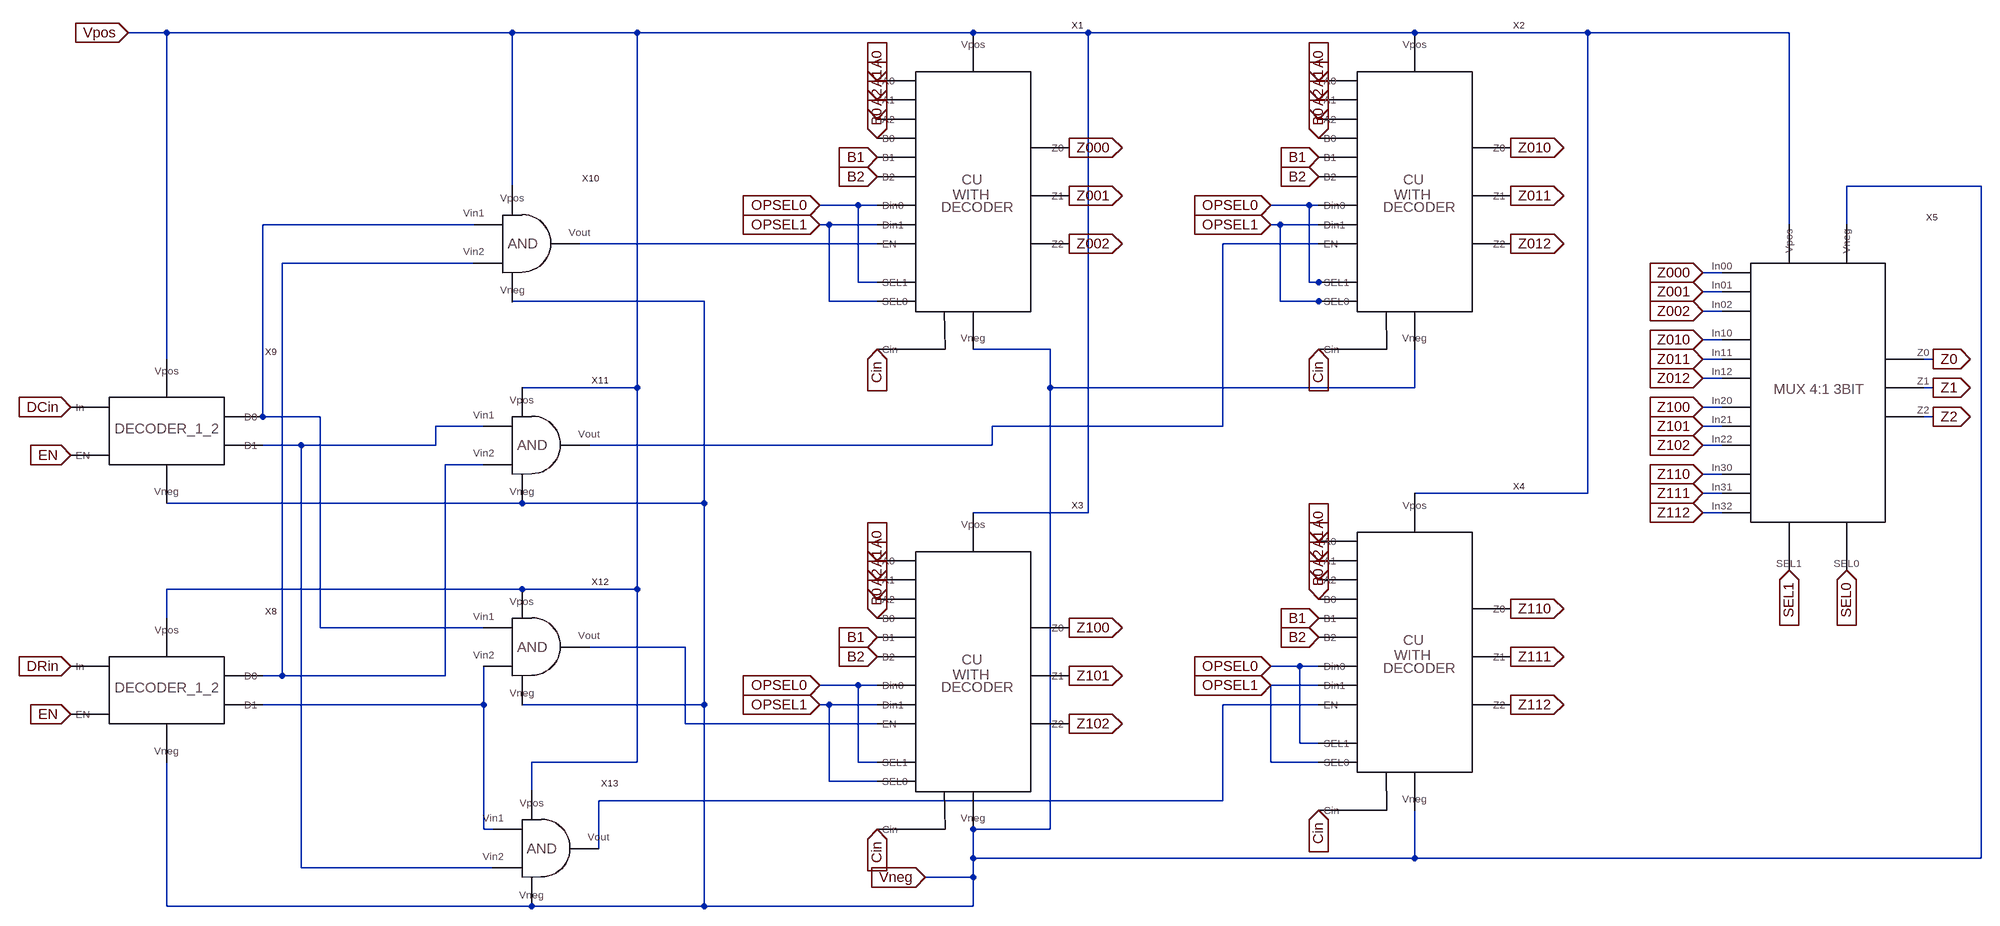
[diagram p0: schematic PART_2_A_SYM.asc]
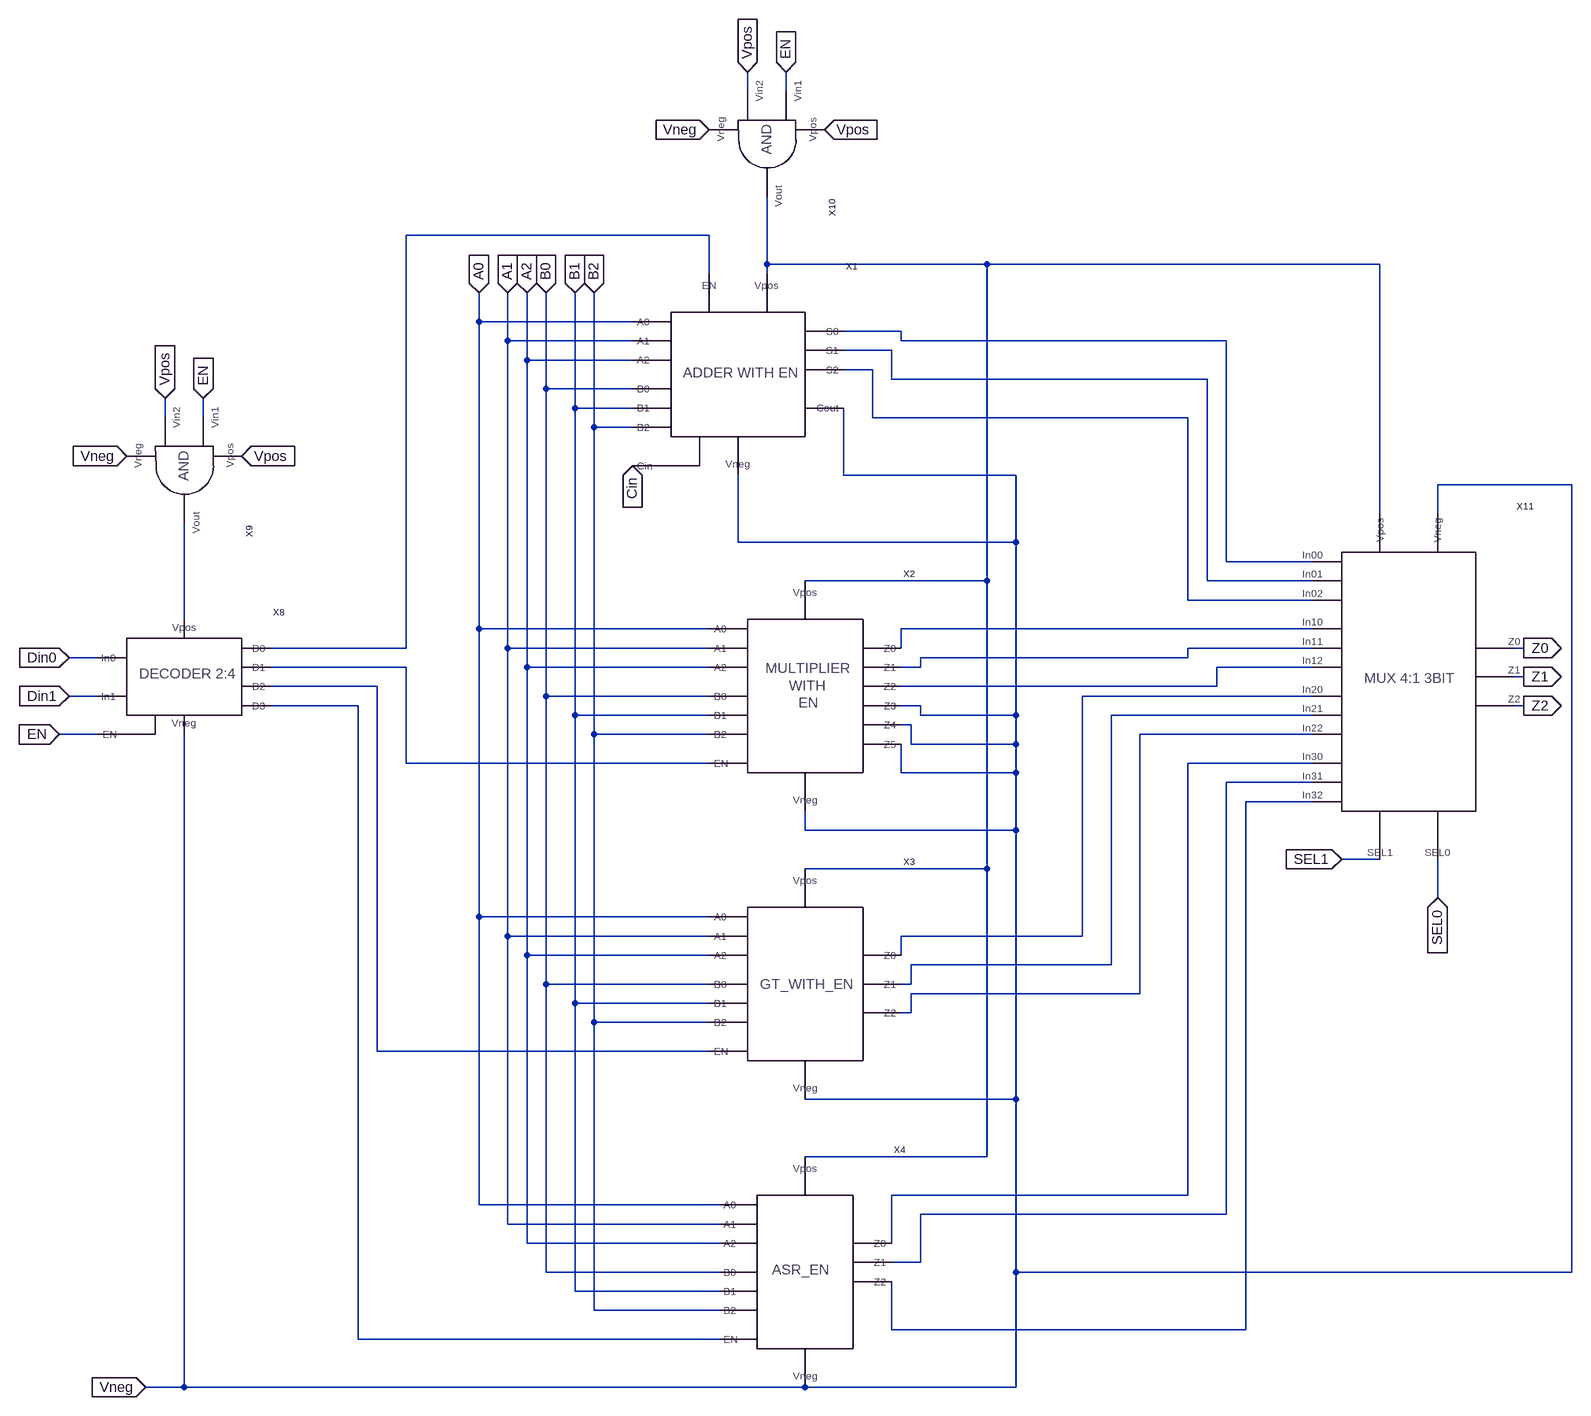
[diagram p1: sub-circuit part_2_b_sym.asc]
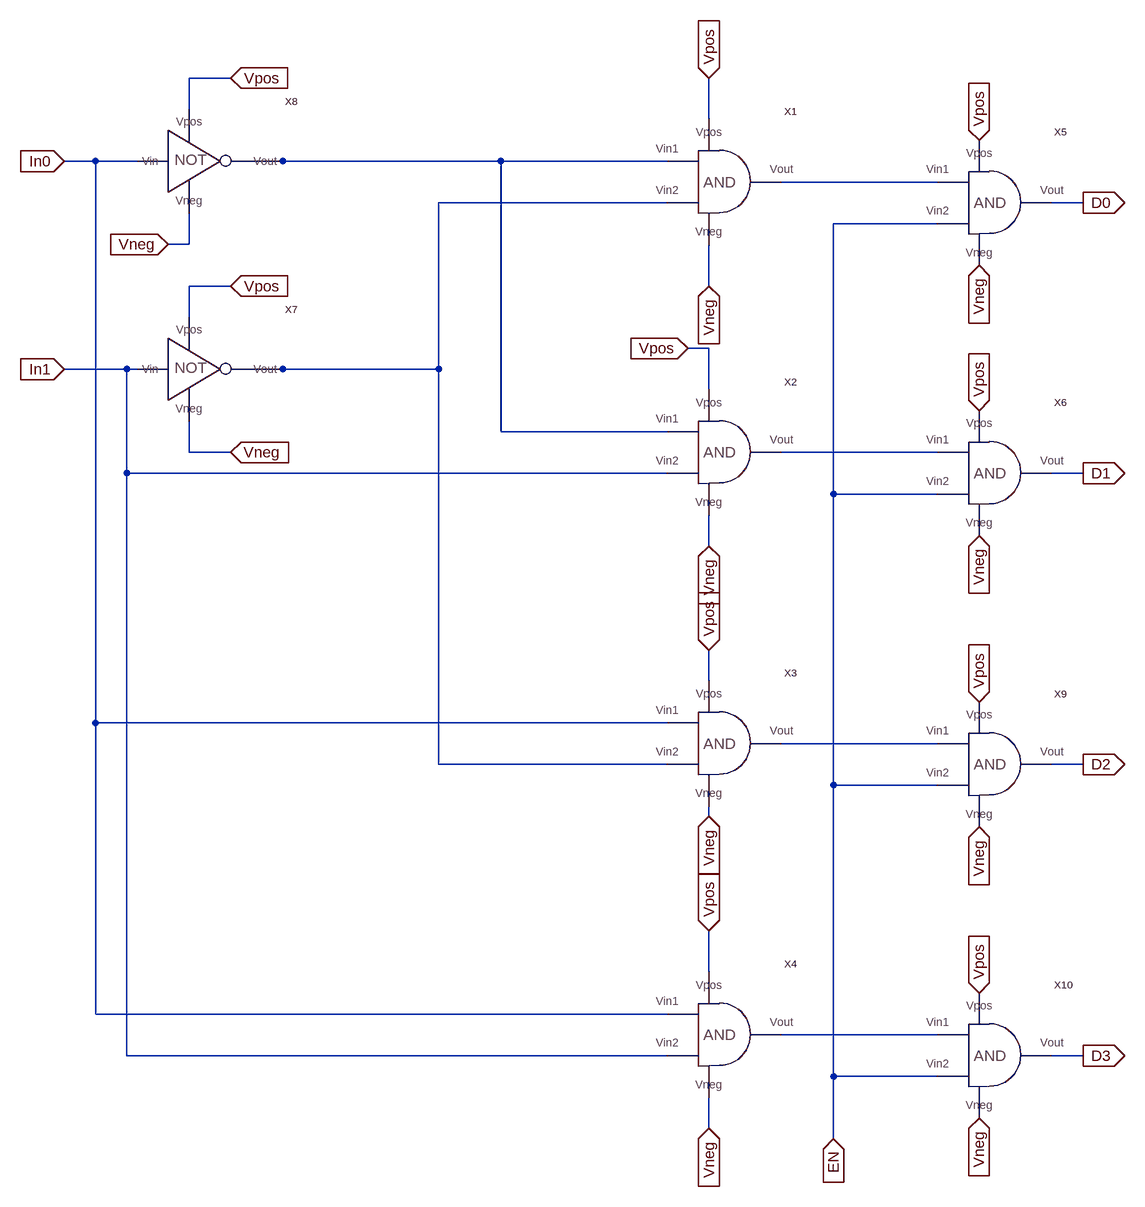
[diagram p2: sub-circuit decoder2_4.asc]
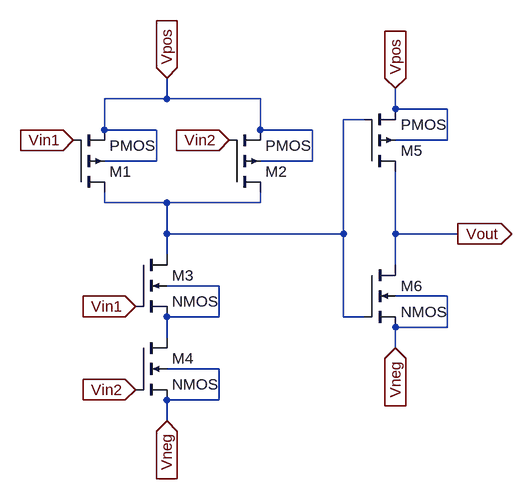
[diagram p3: sub-circuit and_sym.asc]
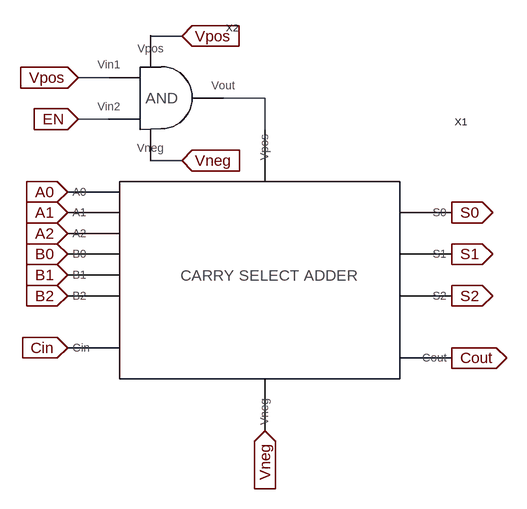
[diagram p4: sub-circuit adder_en_sym.asc]
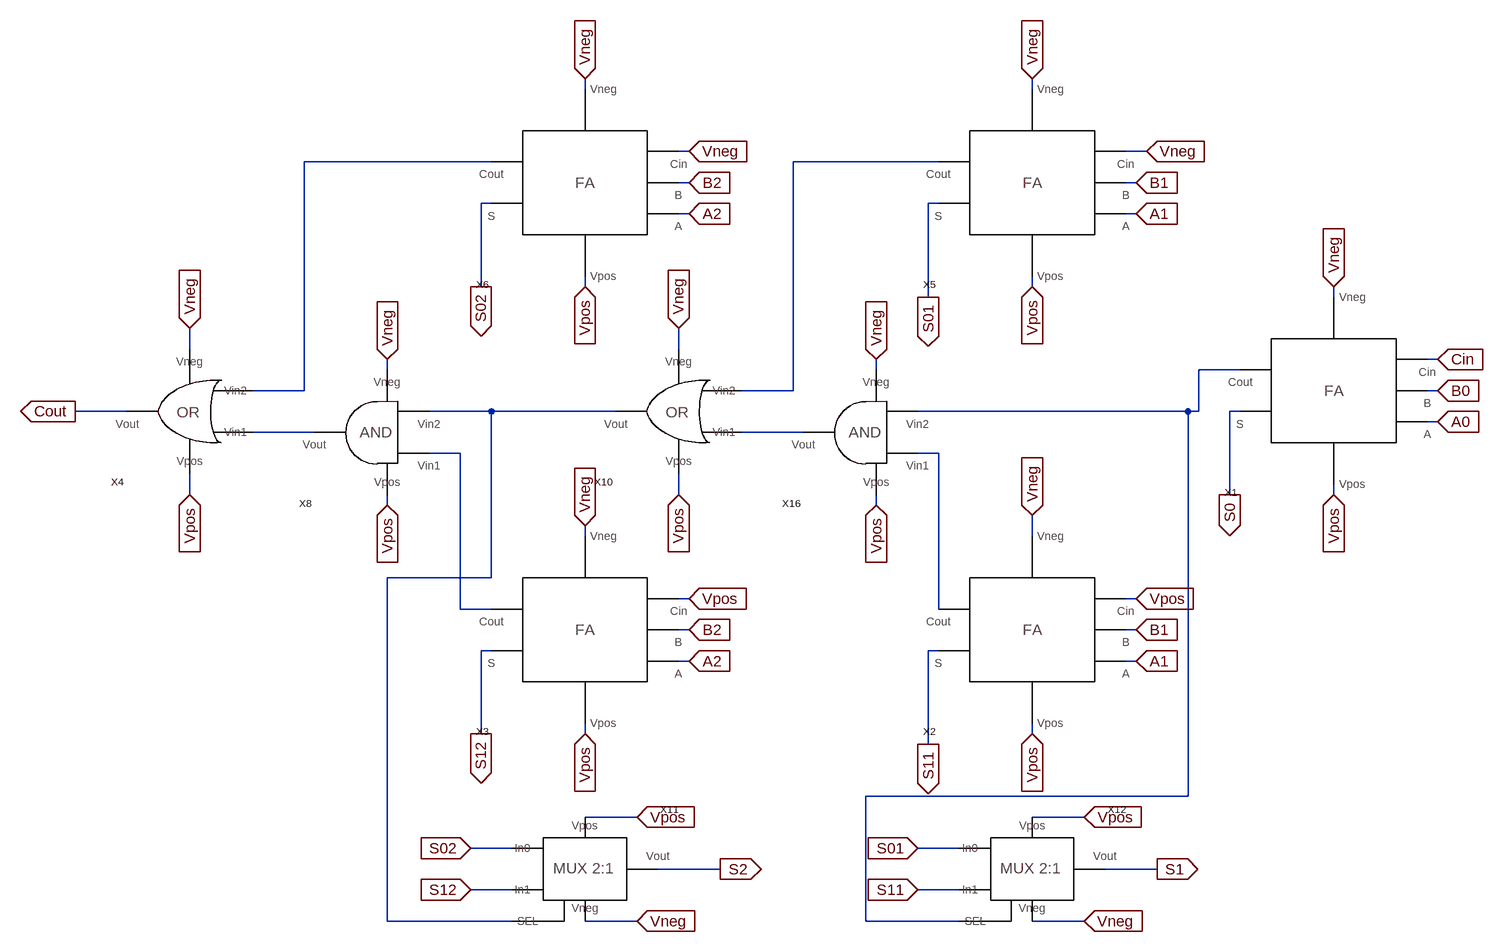
[diagram p5: sub-circuit carry_select_adder_sym.asc]
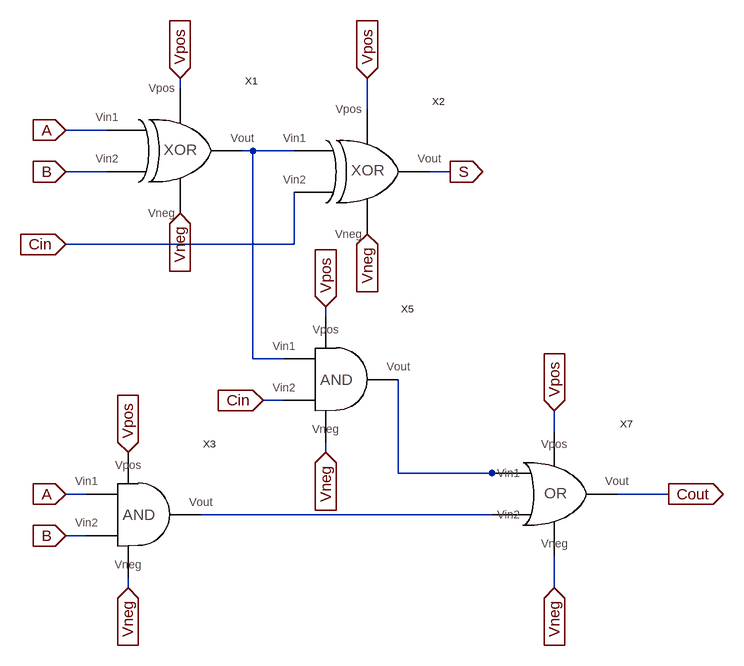
[diagram p6: sub-circuit full_adder_sym.asc]
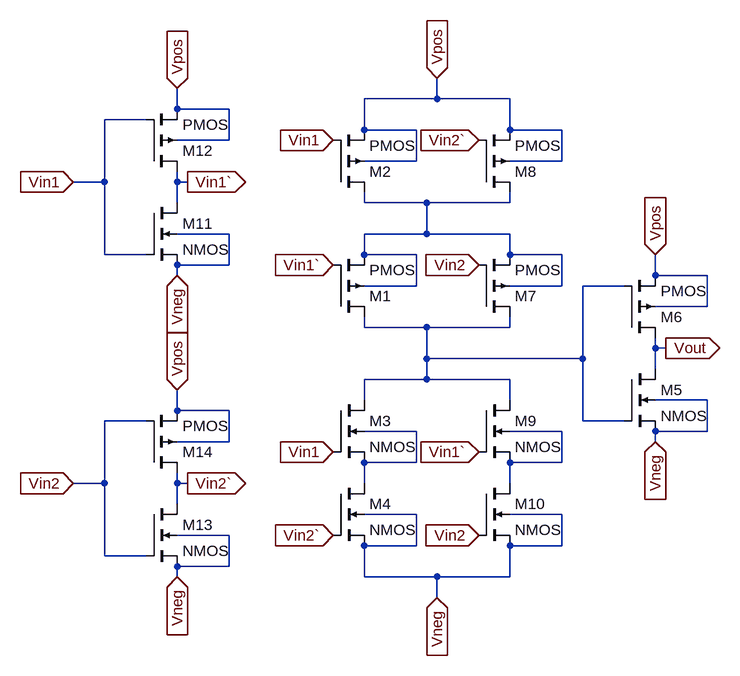
[diagram p7: sub-circuit xor_sym.asc]
PART_2_A_SYM.asc, the LTspice schematic file:
Version 4
SHEET 1 1832 1036
WIRE -1408 -448 -1472 -448
WIRE -832 -448 -1408 -448
WIRE -624 -448 -832 -448
WIRE -64 -448 -624 -448
WIRE 128 -448 -64 -448
WIRE 672 -448 128 -448
WIRE 960 -448 672 -448
WIRE 1296 -448 960 -448
WIRE -832 -192 -832 -448
WIRE 1616 -192 1392 -192
WIRE -256 -160 -320 -160
WIRE -224 -160 -256 -160
WIRE 496 -160 432 -160
WIRE 512 -160 496 -160
WIRE -896 -128 -1248 -128
WIRE -304 -128 -320 -128
WIRE -224 -128 -304 -128
WIRE 448 -128 432 -128
WIRE 512 -128 448 -128
WIRE 1296 -128 1296 -448
WIRE 1392 -128 1392 -192
WIRE -224 -96 -720 -96
WIRE 512 -96 352 -96
WIRE -896 -64 -1216 -64
WIRE 1184 -48 1152 -48
WIRE -256 -32 -256 -160
WIRE -224 -32 -256 -32
WIRE 496 -32 496 -160
WIRE 512 -32 496 -32
WIRE 528 -32 512 -32
WIRE 1184 -16 1152 -16
WIRE -512 0 -832 0
WIRE -304 0 -304 -128
WIRE -224 0 -304 0
WIRE 448 0 448 -128
WIRE 512 0 448 0
WIRE 528 0 512 0
WIRE 1184 16 1152 16
WIRE 1184 64 1152 64
WIRE 64 80 -64 80
WIRE -1408 96 -1408 -448
WIRE 1184 96 1152 96
WIRE 1536 96 1520 96
WIRE 1184 128 1152 128
WIRE -624 144 -624 -448
WIRE -624 144 -816 144
WIRE 64 144 64 80
WIRE 672 144 672 80
WIRE 672 144 64 144
WIRE 1536 144 1520 144
WIRE 1184 176 1152 176
WIRE -1248 192 -1248 -128
WIRE -1152 192 -1248 192
WIRE 1536 192 1520 192
WIRE -880 208 -960 208
WIRE 352 208 352 -96
WIRE 352 208 -32 208
WIRE 1184 208 1152 208
WIRE -1184 240 -1248 240
WIRE -960 240 -960 208
WIRE -960 240 -1184 240
WIRE -32 240 -32 208
WIRE -32 240 -704 240
WIRE 1184 240 1152 240
WIRE -880 272 -944 272
WIRE 1184 288 1152 288
WIRE 960 320 960 -448
WIRE 960 320 672 320
WIRE 1184 320 1152 320
WIRE -816 336 -1408 336
WIRE -512 336 -512 0
WIRE -512 336 -816 336
WIRE 128 352 128 -448
WIRE 128 352 -64 352
WIRE 1184 352 1152 352
WIRE -816 480 -1408 480
WIRE -624 480 -624 144
WIRE -624 480 -816 480
WIRE -1408 528 -1408 480
WIRE -1152 544 -1152 192
WIRE -880 544 -1152 544
WIRE -544 576 -704 576
WIRE 480 608 432 608
WIRE 512 608 480 608
WIRE -1216 624 -1216 -64
WIRE -1216 624 -1248 624
WIRE -944 624 -944 272
WIRE -944 624 -1216 624
WIRE -256 640 -320 640
WIRE -224 640 -256 640
WIRE 512 640 432 640
WIRE -880 672 -880 608
WIRE -880 672 -1248 672
WIRE -512 672 -512 336
WIRE -512 672 -816 672
WIRE -304 672 -320 672
WIRE -224 672 -304 672
WIRE 512 672 352 672
WIRE -544 704 -544 576
WIRE -224 704 -544 704
WIRE 480 736 480 608
WIRE 512 736 480 736
WIRE -624 768 -624 480
WIRE -624 768 -800 768
WIRE -256 768 -256 640
WIRE -224 768 -256 768
WIRE 432 768 432 640
WIRE 512 768 432 768
WIRE -304 800 -304 672
WIRE -224 800 -304 800
WIRE -800 816 -800 768
WIRE 352 832 352 672
WIRE 352 832 -688 832
WIRE -880 880 -880 672
WIRE -864 880 -880 880
WIRE 64 880 64 144
WIRE 64 880 -64 880
WIRE -688 912 -688 832
WIRE -64 928 -64 880
WIRE 672 928 672 848
WIRE 672 928 -64 928
WIRE 1616 928 1616 -192
WIRE 1616 928 672 928
WIRE -1184 944 -1184 240
WIRE -864 944 -1184 944
WIRE -64 960 -64 928
WIRE -64 960 -144 960
WIRE -1408 1008 -1408 768
WIRE -800 1008 -1408 1008
WIRE -512 1008 -512 672
WIRE -512 1008 -800 1008
WIRE -64 1008 -64 960
WIRE -64 1008 -512 1008
FLAG -224 -368 A0
IOPIN -224 -368 In
FLAG -224 -336 A1
IOPIN -224 -336 In
FLAG -224 -304 A2
IOPIN -224 -304 In
FLAG -224 -272 B0
IOPIN -224 -272 In
FLAG -224 -240 B1
IOPIN -224 -240 In
FLAG -224 -208 B2
IOPIN -224 -208 In
FLAG -1568 176 DCin
IOPIN -1568 176 In
FLAG -1568 608 DRin
IOPIN -1568 608 In
FLAG 1296 448 SEL1
IOPIN 1296 448 In
FLAG 1392 448 SEL0
IOPIN 1392 448 In
FLAG -320 -160 OPSEL0
IOPIN -320 -160 In
FLAG -320 -128 OPSEL1
IOPIN -320 -128 In
FLAG -1568 256 EN
IOPIN -1568 256 In
FLAG -1568 688 EN
IOPIN -1568 688 In
FLAG -224 432 A0
IOPIN -224 432 In
FLAG -224 464 A1
IOPIN -224 464 In
FLAG -224 496 A2
IOPIN -224 496 In
FLAG -224 528 B0
IOPIN -224 528 In
FLAG -224 560 B1
IOPIN -224 560 In
FLAG -224 592 B2
IOPIN -224 592 In
FLAG 1536 96 Z0
IOPIN 1536 96 Out
FLAG 1536 144 Z1
IOPIN 1536 144 Out
FLAG 1536 192 Z2
IOPIN 1536 192 Out
FLAG -1472 -448 Vpos
IOPIN -1472 -448 In
FLAG 512 -368 A0
IOPIN 512 -368 In
FLAG 512 -336 A1
IOPIN 512 -336 In
FLAG 512 -304 A2
IOPIN 512 -304 In
FLAG 512 -272 B0
IOPIN 512 -272 In
FLAG 512 -240 B1
IOPIN 512 -240 In
FLAG 512 -208 B2
IOPIN 512 -208 In
FLAG 512 400 A0
IOPIN 512 400 In
FLAG 512 432 A1
IOPIN 512 432 In
FLAG 512 464 A2
IOPIN 512 464 In
FLAG 512 496 B0
IOPIN 512 496 In
FLAG 512 528 B1
IOPIN 512 528 In
FLAG 512 560 B2
IOPIN 512 560 In
FLAG 96 -256 Z000
IOPIN 96 -256 Out
FLAG 96 -176 Z001
IOPIN 96 -176 Out
FLAG 96 -96 Z002
IOPIN 96 -96 Out
FLAG 96 544 Z100
IOPIN 96 544 Out
FLAG 96 624 Z101
IOPIN 96 624 Out
FLAG 96 704 Z102
IOPIN 96 704 Out
FLAG 832 512 Z110
IOPIN 832 512 Out
FLAG 832 592 Z111
IOPIN 832 592 Out
FLAG 832 672 Z112
IOPIN 832 672 Out
FLAG 832 -256 Z010
IOPIN 832 -256 Out
FLAG 832 -176 Z011
IOPIN 832 -176 Out
FLAG 832 -96 Z012
IOPIN 832 -96 Out
FLAG 1152 -48 Z000
IOPIN 1152 -48 In
FLAG 1152 64 Z010
IOPIN 1152 64 In
FLAG 1152 176 Z100
IOPIN 1152 176 In
FLAG 1152 288 Z110
IOPIN 1152 288 In
FLAG 1152 -16 Z001
IOPIN 1152 -16 In
FLAG 1152 96 Z011
IOPIN 1152 96 In
FLAG 1152 208 Z101
IOPIN 1152 208 In
FLAG 1152 320 Z111
IOPIN 1152 320 In
FLAG 1152 16 Z002
IOPIN 1152 16 In
FLAG 1152 128 Z012
IOPIN 1152 128 In
FLAG 1152 240 Z102
IOPIN 1152 240 In
FLAG 1152 352 Z112
IOPIN 1152 352 In
FLAG -144 960 Vneg
IOPIN -144 960 In
FLAG 512 848 Cin
IOPIN 512 848 In
FLAG -224 880 Cin
IOPIN -224 880 In
FLAG 512 80 Cin
IOPIN 512 80 In
FLAG -224 80 Cin
IOPIN -224 80 In
FLAG 432 -160 OPSEL0
IOPIN 432 -160 In
FLAG 432 -128 OPSEL1
IOPIN 432 -128 In
FLAG -320 640 OPSEL0
IOPIN -320 640 In
FLAG -320 672 OPSEL1
IOPIN -320 672 In
FLAG 432 608 OPSEL0
IOPIN 432 608 In
FLAG 432 640 OPSEL1
IOPIN 432 640 In
SYMBOL part_2_b_sym -64 -176 R0
SYMATTR InstName X1
SYMBOL part_2_b_sym 672 -176 R0
SYMATTR InstName X2
SYMBOL part_2_b_sym -64 624 R0
SYMATTR InstName X3
SYMBOL part_2_b_sym 672 592 R0
SYMATTR InstName X4
SYMBOL DECODER_1_2_SYM -1408 640 R0
SYMATTR InstName X8
SYMBOL DECODER_1_2_SYM -1408 208 R0
SYMATTR InstName X9
SYMBOL AND_SYM -816 -96 R0
SYMATTR InstName X10
SYMBOL AND_SYM -800 240 R0
SYMATTR InstName X11
SYMBOL AND_SYM -800 576 R0
SYMATTR InstName X12
SYMBOL AND_SYM -784 912 R0
SYMATTR InstName X13
SYMBOL MUX3BIT_SYM 1344 64 R0
SYMATTR InstName X5

The netlist it stands for:
* PART_2_A_SYM.asc
XX1 A0 A1 A2 B0 B1 B2 OPSEL0 OPSEL1 N002 OPSEL0 OPSEL1 Vpos Vneg Z000 Z001 Z002 Cin part_2_b_sym
XX2 A0 A1 A2 B0 B1 B2 OPSEL0 OPSEL1 N003 OPSEL0 OPSEL1 Vpos Vneg Z010 Z011 Z012 Cin part_2_b_sym
XX3 A0 A1 A2 B0 B1 B2 OPSEL0 OPSEL1 N006 OPSEL0 OPSEL1 Vpos Vneg Z100 Z101 Z102 Cin part_2_b_sym
XX4 A0 A1 A2 B0 B1 B2 OPSEL0 OPSEL1 N008 OPSEL0 OPSEL1 Vpos Vneg Z110 Z111 Z112 Cin part_2_b_sym
XX8 DRin EN Vpos Vneg N004 N007 decoder_1_2_sym
XX9 DCin EN Vpos Vneg N001 N005 decoder_1_2_sym
XX10 N001 N004 Vpos Vneg N002 and_sym
XX11 N005 N004 Vpos Vneg N003 and_sym
XX12 N001 N007 Vpos Vneg N006 and_sym
XX13 N007 N005 Vpos Vneg N008 and_sym
XX5 Vpos Vneg Z000 Z001 Z002 Z010 Z011 Z012 Z100 Z101 Z102 Z110 Z111 Z112 Z0 Z1 Z2 SEL0 SEL1 mux3bit_sym

* block symbol definitions
.subckt part_2_b_sym A0 A1 A2 B0 B1 B2 Din0 Din1 EN SEL1 SEL0 Vpos Vneg Z0 Z1 Z2 Cin
XX8 Din0 Din1 N001 N009 N011 N013 Vneg N006 EN decoder2_4
XX1 A0 A1 A2 B0 B1 B2 N002 N001 Vneg N003 N004 N005 Vneg Cin adder_en_sym
XX2 A0 A1 A2 B0 B1 B2 N009 N002 N007 Vneg N008 N010 Vneg Vneg Vneg multiplier_en_sym
XX3 A0 A1 A2 B0 B1 B2 N011 N002 N012 N014 N015 Vneg gt_en_sym
XX4 N002 A0 A1 A2 B0 B1 B2 N013 Vneg N016 N017 N018 asr_en_sym
XX9 EN Vpos Vpos Vneg N006 and_sym
XX10 EN Vpos Vpos Vneg N002 and_sym
XX11 N002 Vneg N003 N004 N005 N007 N008 N010 N012 N014 N015 N016 N017 N018 Z0 Z1 Z2 SEL0 SEL1 mux3bit_sym
.ends part_2_b_sym

.subckt decoder2_4 In0 In1 D0 D1 D2 D3 Vneg Vpos EN
XX1 N001 N003 Vpos Vneg N002 and_sym
XX2 N001 In1 Vpos Vneg N004 and_sym
XX3 In0 N003 Vpos Vneg N005 and_sym
XX4 In0 In1 Vpos Vneg N006 and_sym
XX7 In1 Vpos N003 Vneg NOT_SYM  ; pins Vin Vpos Vout Vneg
XX8 In0 Vpos N001 Vneg NOT_SYM  ; pins Vin Vpos Vout Vneg
XX5 N002 EN Vpos Vneg D0 and_sym
XX6 N004 EN Vpos Vneg D1 and_sym
XX9 N005 EN Vpos Vneg D2 and_sym
XX10 N006 EN Vpos Vneg D3 and_sym
.ends decoder2_4

.subckt and_sym Vin1 Vin2 Vpos Vneg Vout
M1 N001 Vin1 Vpos Vpos PMOS
M2 N001 Vin2 Vpos Vpos PMOS
M3 N001 Vin1 N002 N002 NMOS
M4 N002 Vin2 Vneg Vneg NMOS
M5 Vout N001 Vpos Vpos PMOS
M6 Vout N001 Vneg Vneg NMOS
.ends and_sym

.subckt adder_en_sym A0 A1 A2 B0 B1 B2 Vpos EN Vneg S0 S1 S2 Cout Cin
XX1 A0 A1 A2 B0 B1 B2 Cout N001 Vneg S0 S1 S2 Cin carry_select_adder_sym
XX2 Vpos EN Vpos Vneg N001 and_sym
.ends adder_en_sym

.subckt carry_select_adder_sym A0 A1 A2 B0 B1 B2 Cout Vpos Vneg S0 S1 S2 Cin
XX1 A0 B0 Cin S0 N003 Vpos Vneg full_adder_sym
XX2 A1 B1 Vpos S11 N008 Vpos Vneg full_adder_sym
XX3 A2 B2 Vpos S12 N007 Vpos Vneg full_adder_sym
XX5 A1 B1 Vneg S01 N002 Vpos Vneg full_adder_sym
XX6 A2 B2 Vneg S02 N001 Vpos Vneg full_adder_sym
XX10 Vpos N006 N002 N004 Vneg or_sym
XX11 S02 S12 N004 Vpos Vneg S2 mux2_1
XX12 S01 S11 N003 Vpos Vneg S1 mux2_1
XX16 N008 N003 Vpos Vneg N006 and_sym
XX4 Vpos N005 N001 Cout Vneg or_sym
XX8 N007 N004 Vpos Vneg N005 and_sym
.ends carry_select_adder_sym

.subckt full_adder_sym A B Cin S Cout Vpos Vneg
XX1 A B Vpos N001 Vneg xor_sym
XX2 N001 Cin Vpos S Vneg xor_sym
XX3 A B Vpos Vneg N003 and_sym
XX5 N001 Cin Vpos Vneg N002 and_sym
XX7 Vpos N002 N003 Cout Vneg or_sym
.ends full_adder_sym

.subckt xor_sym Vin1 Vin2 Vpos Vout Vneg
M1 N002 Vin1` N001 N001 PMOS
M2 N001 Vin1 Vpos Vpos PMOS
M3 N002 Vin1 N003 N003 NMOS
M4 N003 Vin2` Vneg Vneg NMOS
M5 Vout N002 Vneg Vneg NMOS
M6 Vout N002 Vpos Vpos PMOS
M7 N002 Vin2 N001 N001 PMOS
M8 N001 Vin2` Vpos Vpos PMOS
M9 N002 Vin1` N004 N004 NMOS
M10 N004 Vin2 Vneg Vneg NMOS
M11 Vin1` Vin1 Vneg Vneg NMOS
M12 Vin1` Vin1 Vpos Vpos PMOS
M13 Vin2` Vin2 Vneg Vneg NMOS
M14 Vin2` Vin2 Vpos Vpos PMOS
.ends xor_sym

.subckt or_sym Vpos Vin1 Vin2 Vout Vneg
M1 N002 Vin1 Vpos Vpos PMOS
M2 N001 Vin2 N002 N002 PMOS
M3 N001 Vin2 Vneg Vneg NMOS
M4 N001 Vin1 Vneg Vneg NMOS
M5 Vout N001 Vpos Vpos PMOS
M6 Vout N001 Vneg Vneg NMOS
.ends or_sym

.subckt mux2_1 In0 In1 SEL Vpos Vneg Vout
XX1 In1 SEL Vpos Vneg N003 and_sym
XX2 In0 N002 Vpos Vneg N001 and_sym
XX4 Vpos N001 N003 Vout Vneg or_sym
XX5 SEL Vpos N002 Vneg NOT_SYM  ; pins Vin Vpos Vout Vneg
.ends mux2_1

.subckt multiplier_en_sym A0 A1 A2 B0 B1 B2 EN Vpos Z0 Vneg Z1 Z2 Z3 Z4 Z5
XX1 A0 A1 A2 B0 B1 B2 N001 Vneg Z0 Z1 Z2 Z3 Z4 Z5 multiplier_sym
XX2 Vpos EN Vpos Vneg N001 and_sym
.ends multiplier_en_sym

.subckt multiplier_sym A0 A1 A2 B0 B1 B2 Vpos Vneg Z0 Z1 Z2 Z3 Z4 Z5
XX2 B0 A0 Vpos Vneg Z0 and_sym
XX4 B0 A1 Vpos Vneg N001 and_sym
XX5 A2 B0 Vpos Vneg N003 and_sym
XX1 N001 N003 Vneg N006 N008 N010 N005 Vpos Vneg Z1 N002 N004 Vneg carry_select_adder_sym
XX3 N002 N004 N005 N007 N009 N011 Z5 Vpos Vneg Z2 Z3 Z4 Vneg carry_select_adder_sym
XX9 B1 A0 Vpos Vneg N006 and_sym
XX10 B1 A1 Vpos Vneg N008 and_sym
XX11 A2 B1 Vpos Vneg N010 and_sym
XX12 B2 A0 Vpos Vneg N007 and_sym
XX13 B2 A1 Vpos Vneg N009 and_sym
XX14 A2 B2 Vpos Vneg N011 and_sym
.ends multiplier_sym

.subckt gt_en_sym A0 A1 A2 B0 B1 B2 EN Vpos Z0 Z1 Z2 Vneg
XX1 A0 A1 A2 B0 B1 B2 Z0 Z1 Z2 N001 Vneg gt_sym
XX2 Vpos EN Vpos Vneg N001 and_sym
.ends gt_en_sym

.subckt gt_sym A0 A1 A2 B0 B1 B2 Z0 Z1 Z2 Vpos Vneg
XX22 Vpos A0 N009 Vpos Vneg Z0 mux2_1
XX23 Vpos A1 N009 Vpos Vneg Z1 mux2_1
XX24 Vpos A2 N009 Vpos Vneg Z2 mux2_1
XX25 Vpos N007 N012 N009 Vneg or_sym
XX1 A2 B2 Vpos N013 Vneg xnor_sym
XX2 A2 P001 Vpos Vneg N008 and_sym
XX3 B2 Vpos P001 Vneg NOT_SYM  ; pins Vin Vpos Vout Vneg
XX4 A1 P002 Vpos Vneg N006 and_sym
XX5 B1 Vpos P002 Vneg NOT_SYM  ; pins Vin Vpos Vout Vneg
XX8 A0 P003 Vpos Vneg N001 and_sym
XX9 B0 Vpos P003 Vneg NOT_SYM  ; pins Vin Vpos Vout Vneg
XX10 A1 B1 Vpos N014 Vneg xnor_sym
XX11 B0 A0 Vpos N015 Vneg xnor_sym
XX12 N013 N014 Vpos Vneg N003 and_sym
XX13 N001 N003 Vpos Vneg N002 and_sym
XX14 N003 N015 Vpos Vneg N011 and_sym
XX15 Vpos N002 N005 N004 Vneg or_sym
XX16 Vpos N004 N008 N007 Vneg or_sym
XX17 N006 N013 Vpos Vneg N005 and_sym
XX6 N007 N011 Vpos N010 Vneg xnor_sym
XX7 N010 N011 Vpos N012 Vneg xnor_sym
.ends gt_sym

.subckt xnor_sym Vin1 Vin2 Vpos Vout Vneg
M1 Vout Vin1` N001 N001 PMOS
M2 N001 Vin1 Vpos Vpos PMOS
M3 Vout Vin1 N002 N002 NMOS
M4 N002 Vin2` Vneg Vneg NMOS
M7 Vout Vin2 N001 N001 PMOS
M8 N001 Vin2` Vpos Vpos PMOS
M9 Vout Vin1` N003 N003 NMOS
M10 N003 Vin2 Vneg Vneg NMOS
M11 Vin1` Vin1 Vneg Vneg NMOS
M12 Vin1` Vin1 Vpos Vpos PMOS
M13 Vin2` Vin2 Vneg Vneg NMOS
M14 Vin2` Vin2 Vpos Vpos PMOS
.ends xnor_sym

.subckt asr_en_sym Vpos A0 A1 A2 B0 B1 B2 EN Vneg Z0 Z1 Z2
XX1 A0 A1 A2 B0 B1 B2 Z0 Z1 Z2 N001 Vneg asr_symbol
XX2 Vpos EN Vpos Vneg N001 and_sym
.ends asr_en_sym

.subckt asr_symbol A0 A1 A2 B0 B1 B2 Z0 Z1 Z2 Vpos Vneg
XX1 Vpos A0 A1 A2 A2 A2 A2 A2 A2 B1 B2 B0 Z0 Vneg mux_8_1_symbol
XX2 Vpos A1 A2 A2 A2 A2 A2 A2 A2 B1 B2 B0 Z1 Vneg mux_8_1_symbol
XX3 Vpos A2 A2 A2 A2 A2 A2 A2 A2 B1 B2 B0 Z2 Vneg mux_8_1_symbol
.ends asr_symbol

.subckt mux_8_1_symbol Vpos In0 In1 In2 In3 In4 In5 In6 In7 SEL1 SEL2 SEL0 Vout Vneg
XX1 N001 Vpos Vneg In0 In1 In2 In3 SEL1 SEL0 mux4_1_sym
XX2 N002 Vpos Vneg In4 In5 In6 In7 SEL1 SEL0 mux4_1_sym
XX3 N001 N002 SEL2 Vpos Vneg Vout mux2_1
.ends mux_8_1_symbol

.subckt mux4_1_sym Vout Vpos Vneg In0 In1 In2 In3 SEL1 SEL0
XX1 In0 In1 SEL0 Vpos Vneg N001 mux2_1
XX2 N001 N002 SEL1 Vpos Vneg Vout mux2_1
XX3 In2 In3 SEL0 Vpos Vneg N002 mux2_1
.ends mux4_1_sym

.subckt mux3bit_sym Vpos Vneg In00 In01 In02 In10 In11 In12 In20 In21 In22 In30 In31 In32 Z0 Z1 Z2 SEL0 SEL1
XX1 Z0 Vpos Vneg In00 In10 In20 In30 SEL1 SEL0 mux4_1_sym
XX2 Z1 Vpos Vneg In01 In11 In21 In31 SEL1 SEL0 mux4_1_sym
XX3 Z2 Vpos Vneg In02 In12 In22 In32 SEL1 SEL0 mux4_1_sym
.ends mux3bit_sym

.subckt decoder_1_2_sym In EN Vpos Vneg D0 D1
XX1 P001 EN Vpos Vneg D0 and_sym
XX2 In Vpos P001 Vneg NOT_SYM  ; pins Vin Vpos Vout Vneg
XX5 In EN Vpos Vneg D1 and_sym
.ends decoder_1_2_sym

.model NMOS NMOS
.model PMOS PMOS
.lib standard.mos
.backanno
.end